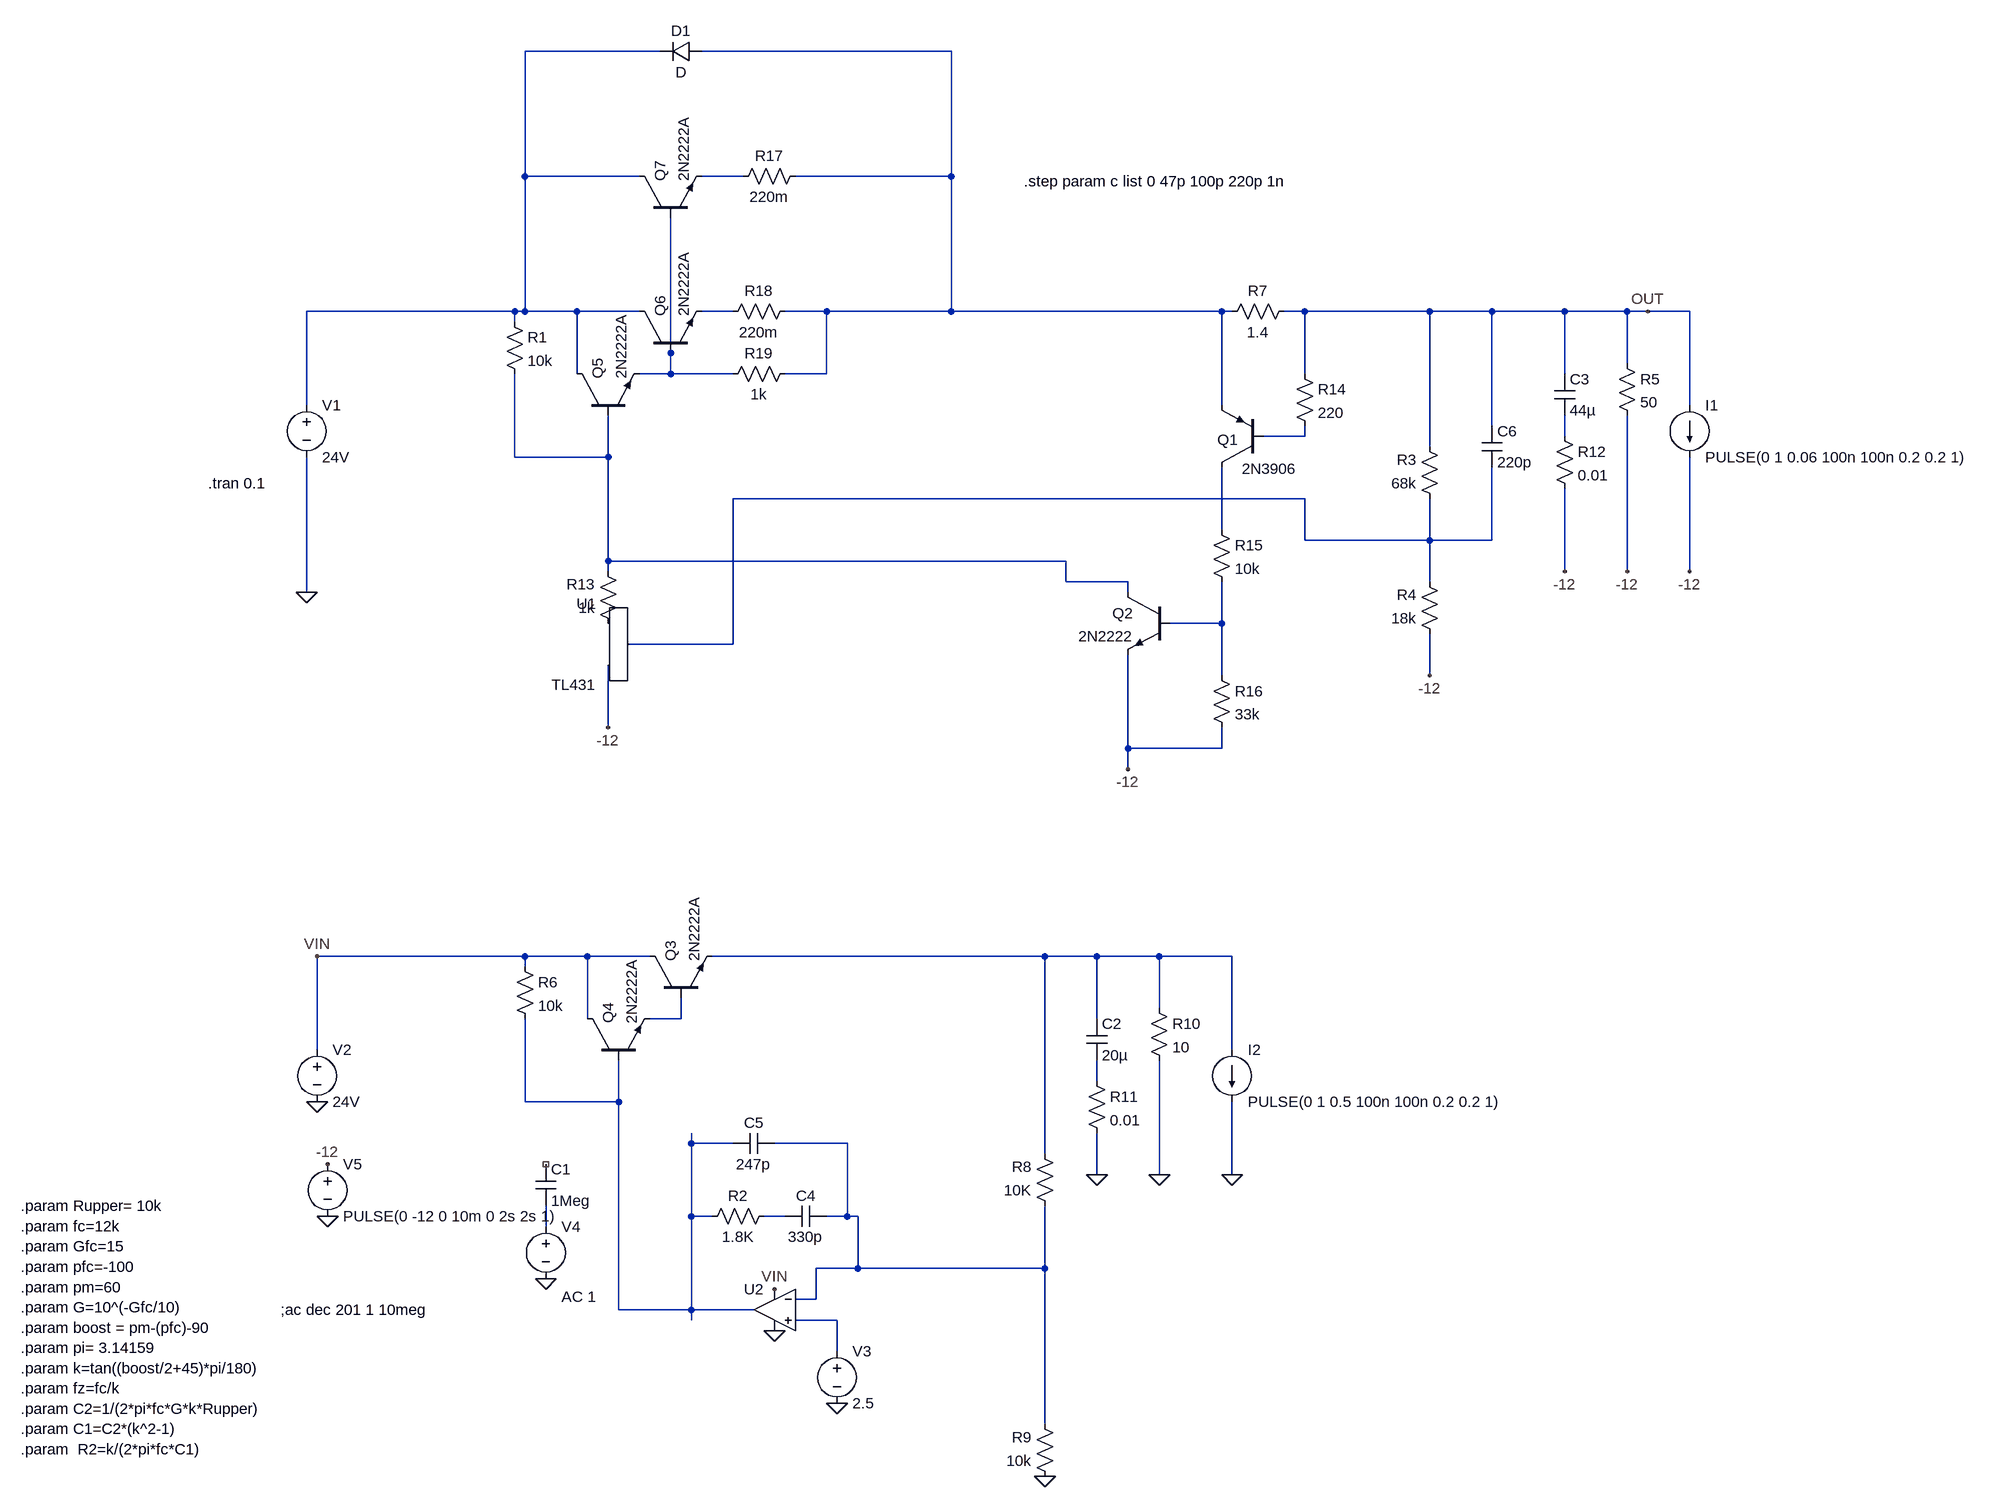
[diagram p0: schematic 5V Linear voltage regulator.asc]
5V Linear voltage regulator.asc, the LTspice schematic file:
Version 4
SHEET 1 2364 1732
WIRE 304 -480 96 -480
WIRE 752 -480 368 -480
WIRE 96 -288 96 -480
WIRE 272 -288 96 -288
WIRE 432 -288 368 -288
WIRE 752 -288 752 -480
WIRE 752 -288 512 -288
WIRE 80 -80 -240 -80
WIRE 96 -80 96 -288
WIRE 96 -80 80 -80
WIRE 176 -80 96 -80
WIRE 272 -80 176 -80
WIRE 416 -80 368 -80
WIRE 560 -80 496 -80
WIRE 752 -80 752 -288
WIRE 752 -80 560 -80
WIRE 1168 -80 752 -80
WIRE 1184 -80 1168 -80
WIRE 1296 -80 1264 -80
WIRE 1488 -80 1296 -80
WIRE 1584 -80 1488 -80
WIRE 1696 -80 1584 -80
WIRE 1792 -80 1696 -80
WIRE 1824 -80 1792 -80
WIRE 1888 -80 1824 -80
WIRE 80 -64 80 -80
WIRE 320 -16 320 -224
WIRE 1792 0 1792 -80
WIRE 176 16 176 -80
WIRE 320 16 320 -16
WIRE 320 16 272 16
WIRE 416 16 320 16
WIRE 560 16 560 -80
WIRE 560 16 496 16
WIRE 1296 16 1296 -80
WIRE 1696 16 1696 -80
WIRE -240 64 -240 -80
WIRE 1168 64 1168 -80
WIRE 1888 64 1888 -80
WIRE 1584 96 1584 -80
WIRE 1296 112 1296 96
WIRE 1296 112 1232 112
WIRE 1696 112 1696 80
WIRE 1488 128 1488 -80
WIRE 80 144 80 16
WIRE 224 144 224 80
WIRE 224 144 80 144
WIRE 1296 208 416 208
WIRE 1168 256 1168 160
WIRE 1296 272 1296 208
WIRE 1488 272 1488 208
WIRE 1488 272 1296 272
WIRE 1584 272 1584 160
WIRE 1584 272 1488 272
WIRE 224 304 224 144
WIRE 928 304 224 304
WIRE 224 320 224 304
WIRE 1696 320 1696 192
WIRE 1792 320 1792 80
WIRE 1888 320 1888 144
WIRE 928 336 928 304
WIRE 1024 336 928 336
WIRE 1488 336 1488 272
WIRE -240 352 -240 144
WIRE 1024 352 1024 336
WIRE 1168 400 1168 336
WIRE 1168 400 1088 400
WIRE 416 432 416 208
WIRE 416 432 256 432
WIRE 1168 480 1168 400
WIRE 1488 480 1488 416
WIRE 224 560 224 464
WIRE 1024 592 1024 448
WIRE 1168 592 1168 560
WIRE 1168 592 1024 592
WIRE 1024 624 1024 592
WIRE 96 912 -224 912
WIRE 192 912 96 912
WIRE 288 912 192 912
WIRE 896 912 384 912
WIRE 976 912 896 912
WIRE 1072 912 976 912
WIRE 1184 912 1072 912
WIRE 96 928 96 912
WIRE 1072 992 1072 912
WIRE 192 1008 192 912
WIRE 336 1008 336 976
WIRE 336 1008 288 1008
WIRE 976 1008 976 912
WIRE -224 1056 -224 912
WIRE 1184 1056 1184 912
WIRE 976 1104 976 1072
WIRE 96 1136 96 1008
WIRE 240 1136 240 1072
WIRE 240 1136 96 1136
WIRE 352 1200 352 1184
WIRE 416 1200 352 1200
WIRE 592 1200 480 1200
WIRE 896 1216 896 912
WIRE 976 1248 976 1184
WIRE 1072 1248 1072 1072
WIRE 1184 1248 1184 1136
WIRE 352 1312 352 1200
WIRE 384 1312 352 1312
WIRE 496 1312 464 1312
WIRE 592 1312 592 1200
WIRE 592 1312 560 1312
WIRE 608 1312 592 1312
WIRE 128 1328 128 1296
WIRE 608 1392 608 1312
WIRE 608 1392 544 1392
WIRE 896 1392 896 1296
WIRE 896 1392 608 1392
WIRE 544 1440 544 1392
WIRE 544 1440 512 1440
WIRE 240 1456 240 1136
WIRE 352 1456 352 1312
WIRE 352 1456 240 1456
WIRE 448 1456 352 1456
WIRE 352 1472 352 1456
WIRE 576 1472 512 1472
WIRE 576 1520 576 1472
WIRE 896 1632 896 1392
FLAG -240 352 0
FLAG 1824 -80 OUT
FLAG 896 1712 0
FLAG -224 1136 0
FLAG 1072 1248 0
FLAG 1184 1248 0
FLAG 480 1488 0
FLAG -224 912 VIN
FLAG 480 1424 VIN
FLAG 576 1600 0
FLAG 128 1408 0
FLAG 976 1248 0
FLAG -208 1312 0
FLAG -208 1232 -12
FLAG 224 560 -12
FLAG 1488 480 -12
FLAG 1696 320 -12
FLAG 1792 320 -12
FLAG 1888 320 -12
FLAG 1024 624 -12
SYMBOL ZZZ\\REF\\TL431 240 400 M0
SYMATTR InstName U1
SYMBOL res 64 -80 R0
SYMATTR InstName R1
SYMATTR Value 10k
SYMBOL res 1504 224 R180
WINDOW 0 36 76 Left 2
WINDOW 3 36 40 Left 2
SYMATTR InstName R3
SYMATTR Value 68k
SYMBOL res 1504 432 R180
WINDOW 0 36 76 Left 2
WINDOW 3 36 40 Left 2
SYMATTR InstName R4
SYMATTR Value 18k
SYMBOL voltage -240 48 R0
WINDOW 123 0 0 Left 0
WINDOW 39 0 0 Left 0
SYMATTR InstName V1
SYMATTR Value 24V
SYMBOL res 1776 -16 R0
SYMATTR InstName R5
SYMATTR Value 50
SYMBOL current 1888 64 R0
WINDOW 123 0 0 Left 0
WINDOW 39 0 0 Left 0
SYMATTR InstName I1
SYMATTR Value PULSE(0 1 0.06 100n 100n 0.2 0.2 1)
SYMBOL npn 288 976 R270
SYMATTR InstName Q3
SYMATTR Value 2N2222A
SYMBOL npn 192 1072 R270
SYMATTR InstName Q4
SYMATTR Value 2N2222A
SYMBOL res 80 912 R0
SYMATTR InstName R6
SYMATTR Value 10k
SYMBOL res 912 1312 R180
WINDOW 0 36 76 Left 2
WINDOW 3 36 40 Left 2
SYMATTR InstName R8
SYMATTR Value 10K
SYMBOL res 912 1728 R180
WINDOW 0 36 76 Left 2
WINDOW 3 36 40 Left 2
SYMATTR InstName R9
SYMATTR Value 10k
SYMBOL voltage -224 1040 R0
WINDOW 123 0 0 Left 0
WINDOW 39 0 0 Left 0
SYMATTR InstName V2
SYMATTR Value 24V
SYMBOL res 1056 976 R0
SYMATTR InstName R10
SYMATTR Value 10
SYMBOL current 1184 1056 R0
WINDOW 123 0 0 Left 0
WINDOW 39 0 0 Left 0
SYMATTR InstName I2
SYMATTR Value PULSE(0 1 0.5 100n 100n 0.2 0.2 1)
SYMBOL OpAmps\\UniversalOpAmp2 480 1456 M0
SYMATTR InstName U2
SYMBOL voltage 576 1504 R0
WINDOW 123 0 0 Left 0
WINDOW 39 0 0 Left 0
SYMATTR InstName V3
SYMATTR Value 2.5
SYMBOL voltage 128 1312 R0
WINDOW 123 24 124 Left 2
WINDOW 39 0 0 Left 0
SYMATTR Value2 AC 1
SYMATTR InstName V4
SYMATTR Value ""
SYMBOL cap 112 1232 R0
SYMATTR InstName C1
SYMATTR Value 1Meg
SYMBOL cap 960 1008 R0
SYMATTR InstName C2
SYMATTR Value 20µ
SYMBOL res 960 1088 R0
SYMATTR InstName R11
SYMATTR Value 0.01
SYMBOL cap 1680 16 R0
SYMATTR InstName C3
SYMATTR Value 44µ
SYMBOL res 1680 96 R0
SYMATTR InstName R12
SYMATTR Value 0.01
SYMBOL npn 176 80 R270
SYMATTR InstName Q5
SYMATTR Value 2N2222A
SYMBOL npn 272 -16 R270
SYMATTR InstName Q6
SYMATTR Value 2N2222A
SYMBOL cap 560 1296 R90
WINDOW 0 0 32 VBottom 2
WINDOW 3 32 32 VTop 2
SYMATTR InstName C4
SYMATTR Value 330p
SYMBOL res 480 1296 R90
WINDOW 0 0 56 VBottom 2
WINDOW 3 32 56 VTop 2
SYMATTR InstName R2
SYMATTR Value 1.8K
SYMBOL cap 480 1184 R90
WINDOW 0 0 32 VBottom 2
WINDOW 3 32 32 VTop 2
SYMATTR InstName C5
SYMATTR Value 247p
SYMBOL voltage -208 1216 R0
WINDOW 123 0 0 Left 0
WINDOW 39 0 0 Left 0
SYMATTR InstName V5
SYMATTR Value PULSE(0 -12 0 10m 0 2s 2s 1)
SYMBOL cap 1568 96 R0
SYMATTR InstName C6
SYMATTR Value 220p
SYMBOL res 1280 -96 R90
WINDOW 0 0 56 VBottom 2
WINDOW 3 32 56 VTop 2
SYMATTR InstName R7
SYMATTR Value 1.4
SYMBOL pnp 1232 160 R180
WINDOW 0 38 43 Left 2
WINDOW 3 -52 -2 Left 2
SYMATTR InstName Q1
SYMATTR Value 2N3906
SYMBOL res 1280 0 R0
SYMATTR InstName R14
SYMATTR Value 220
SYMBOL npn 1088 352 M0
SYMATTR InstName Q2
SYMATTR Value 2N2222
SYMBOL res 240 416 R180
WINDOW 0 36 76 Left 2
WINDOW 3 36 40 Left 2
SYMATTR InstName R13
SYMATTR Value 1k
SYMBOL res 1152 240 R0
SYMATTR InstName R15
SYMATTR Value 10k
SYMBOL res 1152 464 R0
SYMATTR InstName R16
SYMATTR Value 33k
SYMBOL npn 272 -224 R270
SYMATTR InstName Q7
SYMATTR Value 2N2222A
SYMBOL res 528 -304 R90
WINDOW 0 0 56 VBottom 2
WINDOW 3 32 56 VTop 2
SYMATTR InstName R17
SYMATTR Value 220m
SYMBOL res 512 -96 R90
WINDOW 0 0 56 VBottom 2
WINDOW 3 32 56 VTop 2
SYMATTR InstName R18
SYMATTR Value 220m
SYMBOL diode 368 -496 R90
WINDOW 0 0 32 VBottom 2
WINDOW 3 32 32 VTop 2
SYMATTR InstName D1
SYMBOL res 512 0 R90
WINDOW 0 0 56 VBottom 2
WINDOW 3 32 56 VTop 2
SYMATTR InstName R19
SYMATTR Value 1k
TEXT -392 184 Left 2 !.tran 0.1
TEXT -280 1456 Left 2 !;ac dec 201 1 10meg
TEXT -680 1296 Left 2 !.param Rupper= 10k\n.param fc=12k\n.param Gfc=15\n.param pfc=-100\n.param pm=60\n.param G=10^(-Gfc/10)\n.param boost = pm-(pfc)-90\n.param pi= 3.14159\n.param k=tan((boost/2+45)*pi/180)\n.param fz=fc/k\n.param C2=1/(2*pi*fc*G*k*Rupper)\n.param C1=C2*(k^2-1)\n.param  R2=k/(2*pi*fc*C1)
TEXT 864 -280 Left 2 !.step param c list 0 47p 100p 220p 1n

The netlist it stands for:
* 5V Linear voltage regulator.asc
XU1 N009 -12 P001 TL431
R1 N001 N008 10k
R3 N009 OUT 68k
R4 -12 N009 18k
V1 N001 0 24V
R5 OUT -12 50
I1 OUT -12 PULSE(0 1 0.06 100n 100n 0.2 0.2 1)
Q3 VIN N013 N012 0 2N2222A
Q4 VIN N015 N013 0 2N2222A
R6 VIN N015 10k
R8 N016 N012 10K
R9 0 N016 10k
V2 VIN 0 24V
R10 N012 0 10
I2 N012 0 PULSE(0 1 0.5 100n 100n 0.2 0.2 1)
XU2 N019 N016 VIN 0 N015 level2 Avol=1Meg GBW=10Meg Slew=10Meg Ilimit=25m Rail=0 Vos=0 En=0 Enk=0 In=0 Ink=0 Rin=500Meg  ; pins In+ In- V+ V- OUT
V3 N019 0 2.5
V4 N018 0 AC 1
C1 NC_01 N018 1Meg
C2 N012 N014 20µ
R11 N014 0 0.01
C3 OUT N007 44µ
R12 N007 -12 0.01
Q5 N001 N008 N005 0 2N2222A
Q6 N001 N005 N004 0 2N2222A
C4 N016 N017 330p
R2 N017 N015 1.8K
C5 N016 N015 247p
V5 -12 0 PULSE(0 -12 0 10m 0 2s 2s 1)
C6 OUT N009 220p
R7 OUT N002 1.4
Q1 N010 N006 N002 0 2N3906
R14 OUT N006 220
Q2 N008 N011 -12 0 2N2222
R13 P001 N008 1k
R15 N010 N011 10k
R16 N011 -12 33k
Q7 N001 N005 N003 0 2N2222A
R17 N002 N003 220m
R18 N002 N004 220m
D1 N002 N001 D
R19 N002 N005 1k
.model D D
.lib standard.dio
.model NPN NPN
.model PNP PNP
.lib standard.bjt
.tran 0.1
;ac dec 201 1 10meg
.param Rupper= 10k
.param fc=12k
.param Gfc=15
.param pfc=-100
.param pm=60
.param G=10^(-Gfc/10)
.param boost = pm-(pfc)-90
.param pi= 3.14159
.param k=tan((boost/2+45)*pi/180)
.param fz=fc/k
.param C2=1/(2*pi*fc*G*k*Rupper)
.param C1=C2*(k^2-1)
.param  R2=k/(2*pi*fc*C1)
.step param c list 0 47p 100p 220p 1n
.lib TL431.mod
.lib UniversalOpAmp2.lib
.backanno
.end